# Altium schematic sheet Regelaar.SchDoc: Soldeerstation
size A4; DrawnBy: Miguel Nunez; DocumentNumber: 2022/001; Revision: v1; SheetNumber: 1; SheetTotal: 6
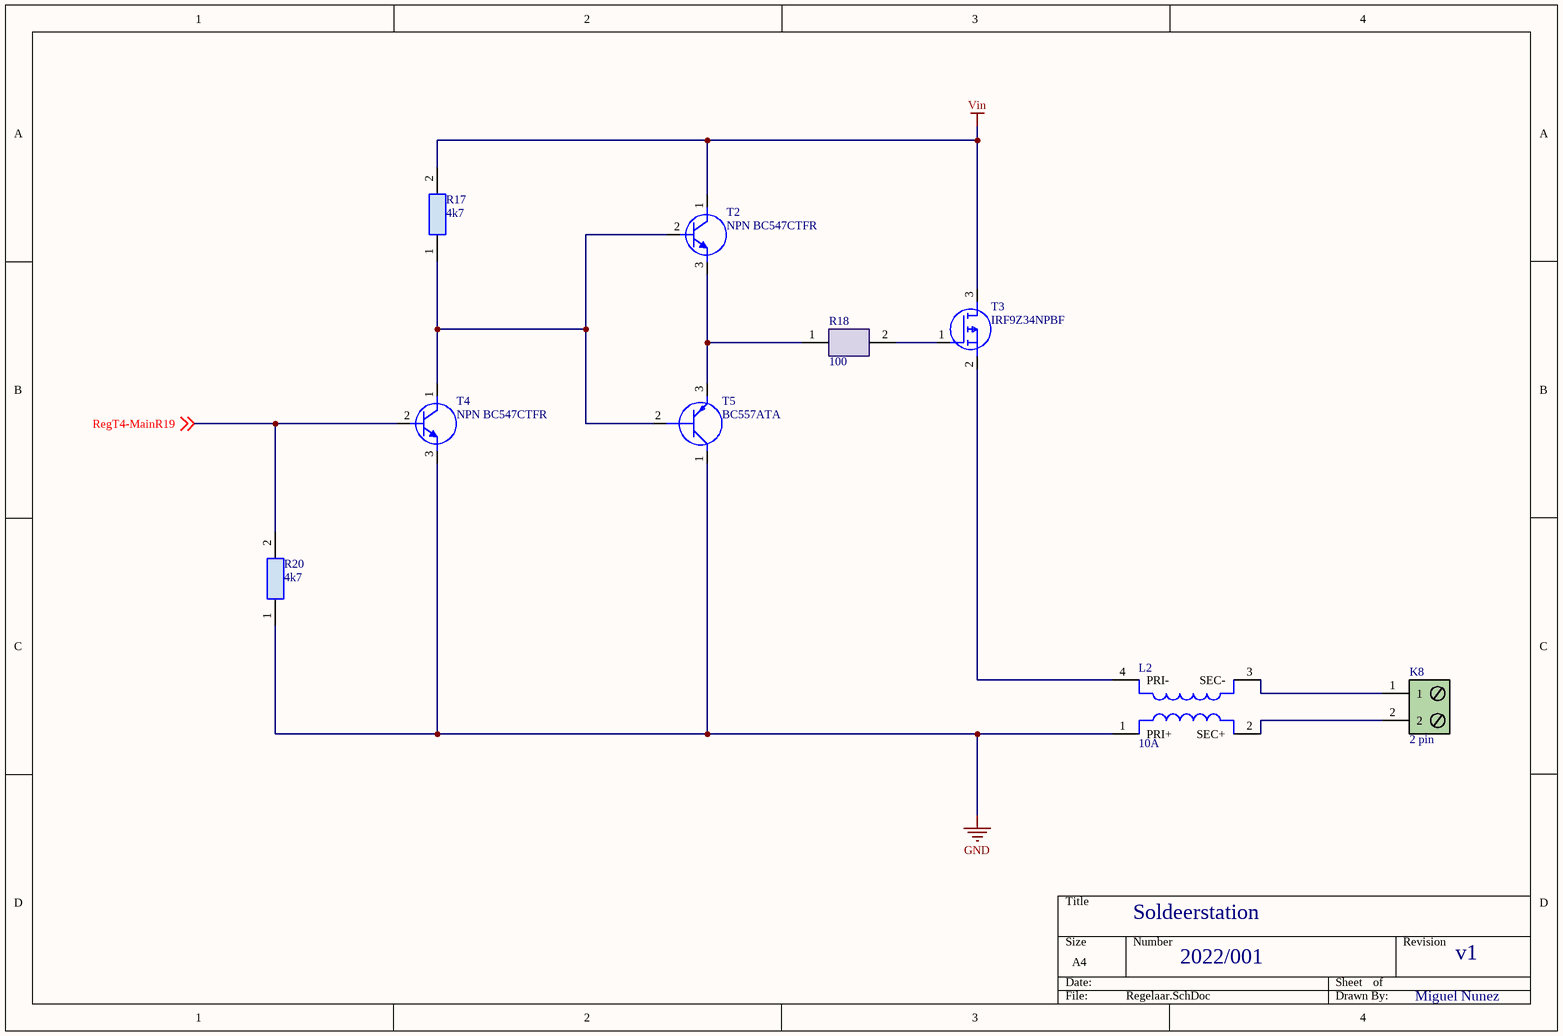
[diagram p0: Regelaar.SchDoc]

## Parts
K8  2 pin  [1729128]
L2  10A  [CM2545X171B10]
R17  4k7  [CAPC2012X65N]
R18  100  [RESC1220X65N]
R20  4k7  [CAPC2012X65N]
T2  NPN BC547CTFR  [BC33740TA]
T3  IRF9Z34NPBF  [TO254P469X1042X1967-3P]
T4  NPN BC547CTFR  [BC33740TA]
T5  BC557ATA  [BC33740TA]

## Nets
GND: L2.1(PRI+) R20.1 T4.3(E) T5.1(C)
Vin: R17.2 T2.1(C) T3.3(D)
RegT4-MainR19: R20.2 T4.2(B) ; off-sheet RegT4-MainR19
NetK8_1: K8.1 L2.3(SEC-)
NetK8_2: K8.2 L2.2(SEC+)
NetL2_4: L2.4(PRI-) T3.2(S)
NetR17_1: R17.1 T2.2(B) T4.1(C) T5.2(B)
NetR18_1: R18.1 T2.3(E) T5.3(E)
NetR18_2: R18.2 T3.1(G)

## Library data of the parts
K8 = Term. blok 2 pin: Connector Term. blok. 1729128 2 pin; Manufacturer_Name: Phoenix Contact; Datasheet Link: http://www.phoenixcontact.com/de/produkte/1729128/pdf; Height: 10.15mm; Manufacturer_Part_Number: 1729128
L2 = CM2545X171B-10: common mode smoorspoel 10A; Manufacturer_Name: Laird Technologies; Datasheet Link: https://datasheet.datasheetarchive.com/originals/dk/DKDS-7/122753.pdf; Height: 9.5mm; Manufacturer_Part_Number: CM2545X171B-10
R17 R20 = RES 4k7 0805: 4k7 SMD 0805  ESR10EZPJ472; Manufacturer_Name: ROHM Semiconductor; Datasheet Link: https://componentsearchengine.com/Datasheets/2/ESR10EZPJ472.pdf; Height: 0.65mm; Manufacturer_Part_Number: ESR10EZPJ472
R18 = RES 100 0508: 100 Ohm SMD 0508  LTR10EZPJ101; Manufacturer_Name: ROHM Semiconductor; Datasheet Link: https://componentsearchengine.com//LTR10EZPJ101.pdf; Height: 0.65mm; Mouser2 Part Number: 755-LTR10EZPJ101; Mouser2 Price/Stock: https://www.mouser.com/Search/Refine.aspx?Keyword=755-LTR10EZPJ101; Manufacturer_Part_Number: LTR10EZPJ101
T2 T4 = TR BC547CTFR: Transistor BC547CTFR NPN; Mfr_Name: onsemi; Type: DEV; Copyright: Copyright (C) 2022 Ultra Librarian. All rights reserved.; Manufacturer_Part_Number: BC547CTFR; RefDes: RefDes
T3 = TR IRF9Z34NPBF: MOSFET (P-Channel); Manufacturer_Name: Infineon; Datasheet Link: https://componentsearchengine.com//IRF9Z34NPBF.pdf; Height: 4.69mm; Mouser2 Part Number: 942-IRF9Z34NPBF; Mouser2 Price/Stock: https://www.mouser.com/Search/Refine.aspx?Keyword=942-IRF9Z34NPBF; Manufacturer_Part_Number: IRF9Z34NPBF
T5 = TR BC557ATA: Transistor BJT BC557ATA PNP; Manufacturer_Name: ON Semiconductor; Datasheet Link: https://componentsearchengine.com//BC557ATA.pdf; Mouser2 Part Number: 512-BC557ATA; Mouser2 Price/Stock: https://www.mouser.com/Search/Refine.aspx?Keyword=512-BC557ATA; Manufacturer_Part_Number: BC557ATA